# Altium schematic sheet Scope_top.SchDoc: SCOPE-F07x: top
size A4; Organization: Draw By: OldGerman; Address2: https://github.com; Address3: /oldgerman/SCOPE-F07x; Revision: v1.1; SheetNumber: 1; SheetTotal: 5
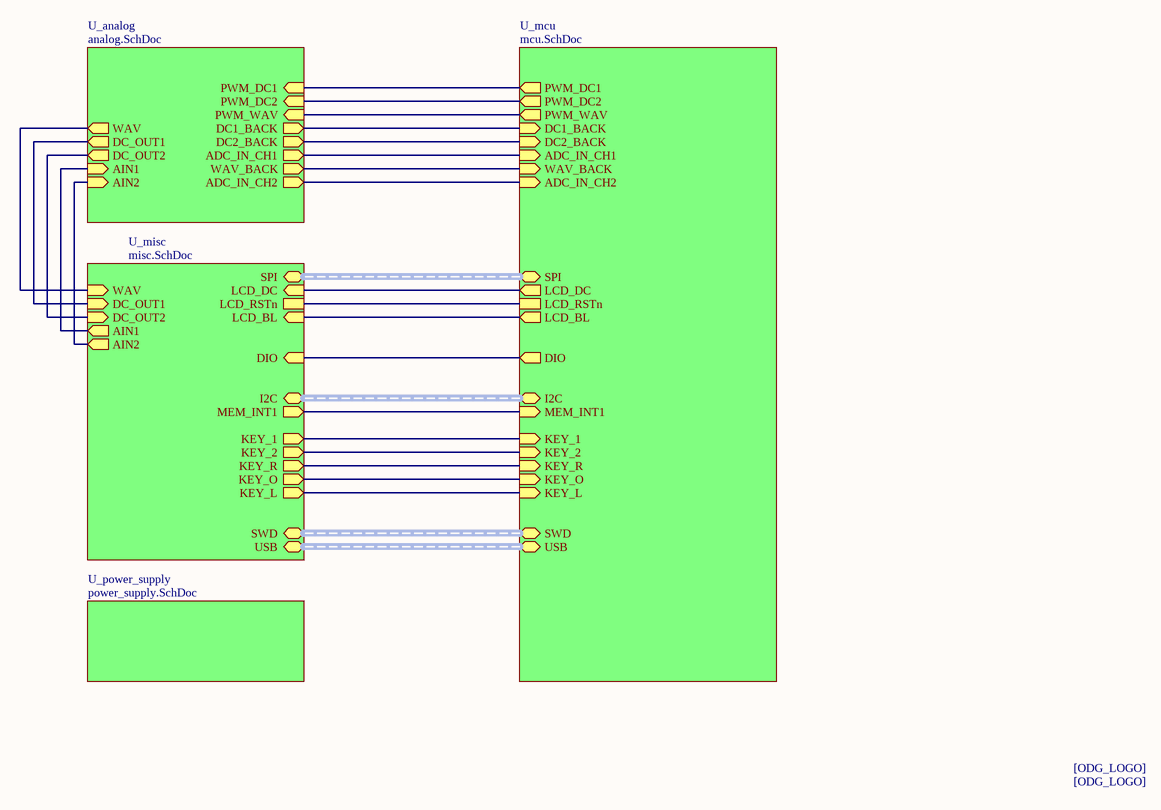
[diagram p0: Scope_top.SchDoc]

## Parts
ODG1  ODG_LOGO  [ODG_LOGO]  (value not drawn)
ODG2  ODG_LOGO  [ODG_LOGO]  (value not drawn)

## Sub-sheets
U_analog = analog.SchDoc: PWM_WAV (in), DC1_BACK (out), DC2_BACK (out), ADC_IN_CH1 (out), WAV_BACK (out), ADC_IN_CH2 (out), WAV (out), DC_OUT1 (out), DC_OUT2 (out), AIN1 (in), AIN2 (in), PWM_DC2 (in), PWM_DC1 (in)
U_mcu = mcu.SchDoc: PWM_WAV (out), DC1_BACK (in), DC2_BACK (in), ADC_IN_CH1 (in), WAV_BACK (in), ADC_IN_CH2 (in), DIO (out), LCD_DC (out), LCD_RSTn, MEM_INT1 (in), KEY_1 (in), KEY_2 (in), KEY_R (in), KEY_O (in), KEY_L (in), USB (bidir, harness USB), PWM_DC2 (out), PWM_DC1 (out), SWD (bidir, harness SWD), I2C (bidir, harness I2C), LCD_BL (out), SPI (bidir, harness SPI)
U_misc = misc.SchDoc: USB (bidir, harness USB), DIO (in), LCD_DC (in), LCD_RSTn, KEY_1 (out), KEY_2 (out), KEY_R (out), KEY_O (out), KEY_L (out), MEM_INT1 (out), WAV (in), DC_OUT1 (in), DC_OUT2 (in), AIN1 (out), AIN2 (out), SWD (bidir, harness SWD), I2C (bidir, harness I2C), LCD_BL (in), SPI (bidir, harness SPI)
U_power_supply = power_supply.SchDoc: no entries

## Nets
(unnamed): sheet U_mcu/PWM_WAV, sheet U_analog/PWM_WAV
(unnamed): sheet U_mcu/DC1_BACK, sheet U_analog/DC1_BACK
(unnamed): sheet U_mcu/DC2_BACK, sheet U_analog/DC2_BACK
(unnamed): sheet U_mcu/ADC_IN_CH1, sheet U_analog/ADC_IN_CH1
(unnamed): sheet U_mcu/WAV_BACK, sheet U_analog/WAV_BACK
(unnamed): sheet U_mcu/ADC_IN_CH2, sheet U_analog/ADC_IN_CH2
(unnamed): sheet U_mcu/DIO, sheet U_misc/DIO
(unnamed): sheet U_mcu/LCD_DC, sheet U_misc/LCD_DC
(unnamed): sheet U_mcu/LCD_RSTn, sheet U_misc/LCD_RSTn
(unnamed): sheet U_mcu/MEM_INT1, sheet U_misc/MEM_INT1
(unnamed): sheet U_mcu/KEY_1, sheet U_misc/KEY_1
(unnamed): sheet U_mcu/KEY_2, sheet U_misc/KEY_2
(unnamed): sheet U_mcu/KEY_R, sheet U_misc/KEY_R
(unnamed): sheet U_mcu/KEY_O, sheet U_misc/KEY_O
(unnamed): sheet U_mcu/KEY_L, sheet U_misc/KEY_L
(unnamed): sheet U_mcu/PWM_DC2, sheet U_analog/PWM_DC2
(unnamed): sheet U_mcu/PWM_DC1, sheet U_analog/PWM_DC1
(unnamed): sheet U_mcu/LCD_BL, sheet U_misc/LCD_BL
(unnamed): sheet U_analog/WAV, sheet U_misc/WAV
(unnamed): sheet U_analog/DC_OUT1, sheet U_misc/DC_OUT1
(unnamed): sheet U_analog/DC_OUT2, sheet U_misc/DC_OUT2
(unnamed): sheet U_analog/AIN1, sheet U_misc/AIN1
(unnamed): sheet U_analog/AIN2, sheet U_misc/AIN2

## Buses and harness runs
harness sheet U_mcu/I2C = sheet U_misc/I2C
harness sheet U_mcu/SPI = sheet U_misc/SPI
harness sheet U_mcu/SWD = sheet U_misc/SWD
harness sheet U_mcu/USB = sheet U_misc/USB

## Notes on the sheet
- Title
- Size:
- Date:
- A4
- Number:
- Time:
- Revision:
- Sheet
- of
- File:
- (in symbol ODG_LOGO) [ODG_LOGO]